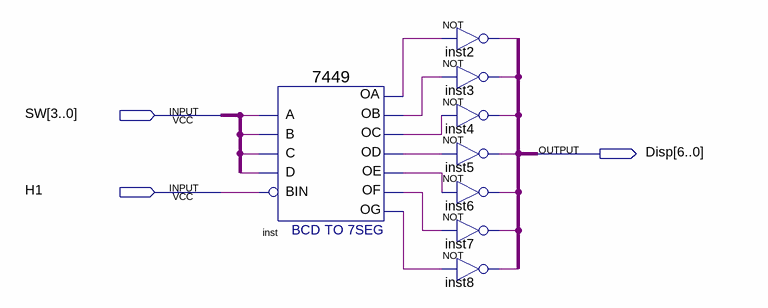
[diagram p0: schematic sheet]
// Quartus schematic TAREA1_A.bdf as structural Verilog: 8 symbols, 3 pins
module TAREA1_A (
  input  [3:0] SW,
  input  H1,
  output [6:0] Disp
);

  wire OA, OB, OC, OD, OE, OF, OG;

  \7449  inst (
    .A(SW[0]), .C(SW[2]), .B(SW[1]), .D(SW[3]), .BIN(H1), .OC(OC), .OD(OD), .OF(OF), .OG(OG), .OB(OB),
    .OA(OA), .OE(OE));
  not inst2 (Disp[0], OA);
  not inst3 (Disp[1], OB);
  not inst4 (Disp[2], OC);
  not inst5 (Disp[3], OD);
  not inst6 (Disp[4], OE);
  not inst7 (Disp[5], OF);
  not inst8 (Disp[6], OG);
endmodule
